# Altium schematic sheet LED.SchDoc: RGB LED.
size 297 x 209 mm; Author: Dmitry Shpakov; Organization: NoName; Revision: Revision; SheetNumber: 8; SheetTotal: 10; PageSize: A4; ProjectName: Project Name
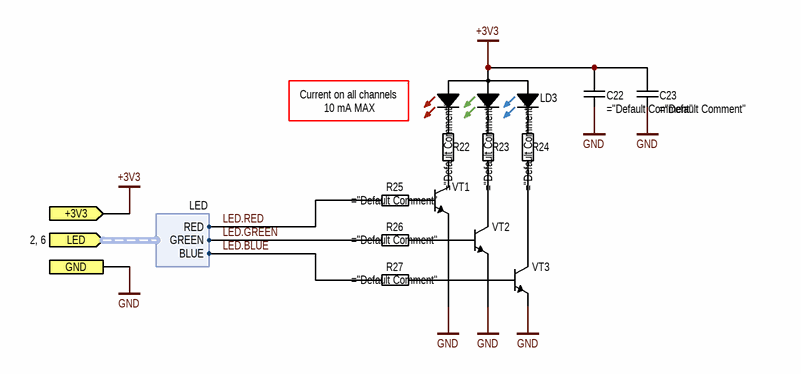
[diagram p0: LED.SchDoc]

## Parts
C22  (no value)
C23  (no value)
LD3  (no value)
R22  (no value)
R23  (no value)
R24  (no value)
R25  (no value)
R26  (no value)
R27  (no value)
VT1  (no value)
VT2  (no value)
VT3  (no value)

## Ports
+3V3 (in, see 2, 3, 6), GND (see 2, 3, 4, 5, 6, 7, 9, 10), LED (in, harness LED, see 2, 6)

## Harnesses
LED: RED, GREEN, BLUE

## Nets
+3V3: C22.2 C23.2 LD3.CA ; port +3V3
GND: C22.1 C23.1 VT1.E VT2.E VT3.E ; port GND
LED.BLUE: R27.1 ; port LED.BLUE
LED.GREEN: R26.1 ; port LED.GREEN
LED.RED: R25.1 ; port LED.RED
NetLD3_BC: LD3.BC R24.2
NetLD3_GC: LD3.GC R23.2
NetLD3_RC: LD3.RC R22.2
NetR22_1: R22.1 VT1.C
NetR23_1: R23.1 VT2.C
NetR24_1: R24.1 VT3.C
NetR25_2: R25.2 VT1.B
NetR26_2: R26.2 VT2.B
NetR27_2: R27.2 VT3.B

## Notes on the sheet
- Current on all channels
  10 mA MAX
- Author
- Date
- Organization
- Page
- Total pages
- Materials
- Page size

## Library data of the parts
C22 = CC0805KPX5R6BB106: CAP CER 10UF 10V X5R 0805; Manufacturer: YAGEO; Type: capacitor; Power Dissipation: * W; Rated Current: * A; Tolerance: 10 %; Other: 10 µF ±10% 10V Ceramic Capacitor X5R 0805 (2012 Metric); Operating Temperature: -55 °C to +85 °C; HelpURL: https://www.digikey.com/en/products/detail/yageo/CC0805KPX5R6BB106/11611309; Default Comment: 10 uF; Rated Voltage: 10 V; Rated Power: * W; Value: 10 uF; Summary: ="Type"+" "+"Part Number"+" "+"Manufacturer"+" "+"Value"+" "+"Tolerance"+" "+"Operating Temperature"+" "+"Case"+" "+"Power Dissipation"+" "+"Rated Current"+" "+"Rated Power"+" "+"Rated Voltage"+" "+"Other"; Assembly: *; Case: 0805; Part Number: CC0805KPX5R6BB106
C23 = CC0805KKX5R6BB105: CAP CER 1UF 10V X5R 0805; Manufacturer: YAGEO; Type: capacitor; Power Dissipation: * W; Rated Current: * A; Tolerance: 10 %; Other: 1 µF ±10% 10V Ceramic Capacitor X5R 0805 (2012 Metric); Operating Temperature: -55 °C to +85 °C; HelpURL: https://www.digikey.com/en/products/detail/yageo/CC0805KKX5R6BB105/2345239; Default Comment: 1 uF; Rated Voltage: 10 V; Rated Power: * W; Value: 1 uF; Summary: ="Type"+" "+"Part Number"+" "+"Manufacturer"+" "+"Value"+" "+"Tolerance"+" "+"Operating Temperature"+" "+"Case"+" "+"Power Dissipation"+" "+"Rated Current"+" "+"Rated Power"+" "+"Rated Voltage"+" "+"Other"; Assembly: *; Case: 0805; Part Number: CC0805KKX5R6BB105
LD3 = 150066M153000: LED RGB DIFFUSED SMD; Manufacturer: Würth Elektronik; Power Dissipation: * W; Tolerance: * %; Other: Red, Green, Blue (RGB) 624nm Red, 525nm Green, 470nm Blue LED Indication - Discrete 2V Red, 3.3V Green, 3.3V Blue 0606 (1616 Metric); Rated Voltage: 2V Red; 3.3V Green; 3.3V Blue; Rated Current: 20 mA; Value: Red; Green; Blue; Operating Temperature: -40 °C to +85 °C; Type: led; HelpURL: https://www.digikey.com/en/products/detail/w%C3%BCrth-elektronik/150066M153000/7315709; Default Comment: 150066M153000; Rated Power: * W; Summary: ="Type"+" "+"Part Number"+" "+"Manufacturer"+" "+"Value"+" "+"Tolerance"+" "+"Operating Temperature"+" "+"Case"+" "+"Power Dissipation"+" "+"Rated Current"+" "+"Rated Power"+" "+"Rated Voltage"+" "+"Other"; Assembly: *; Case: 0606; Part Number: 150066M153000
R22 R23 = RC0603FR-0710RL: RES 10 OHM 1% 1/10W 0603; Manufacturer: YAGEO; Default Comment: 10R; Power Dissipation: 0.1 W; Rated Voltage: * V; Rated Current: * A; Value: 10R; Other: 10 Ohms ±1% 0.1W, 1/10W Chip Resistor 0603 (1608 Metric) Moisture Resistant Thick Film; Operating Temperature: -55 °C to +155 °C; Type: resistor; HelpURL: https://www.digikey.com/en/products/detail/yageo/RC0603FR-0710RL/726879; Rated Power: 0.1 W; Tolerance: 1 %; Summary: ="Type"+" "+"Part Number"+" "+"Manufacturer"+" "+"Value"+" "+"Tolerance"+" "+"Operating Temperature"+" "+"Case"+" "+"Power Dissipation"+" "+"Rated Current"+" "+"Rated Power"+" "+"Rated Voltage"+" "+"Other"; Assembly: *; Case: 0603; Part Number: RC0603FR-0710RL
R24 = RC0603FR-07133RL: RES 133 OHM 1% 1/10W 0603; Manufacturer: YAGEO; Default Comment: 133R; Power Dissipation: 0.1 W; Rated Voltage: * V; Rated Current: * A; Value: 133R; Other: 133 Ohms ±1% 0.1W, 1/10W Chip Resistor 0603 (1608 Metric) Moisture Resistant Thick Film; Operating Temperature: -55 °C to +155 °C; Type: resistor; HelpURL: https://www.digikey.com/en/products/detail/yageo/RC0603FR-07133RL/726936; Rated Power: 0.1 W; Tolerance: 1 %; Summary: ="Type"+" "+"Part Number"+" "+"Manufacturer"+" "+"Value"+" "+"Tolerance"+" "+"Operating Temperature"+" "+"Case"+" "+"Power Dissipation"+" "+"Rated Current"+" "+"Rated Power"+" "+"Rated Voltage"+" "+"Other"; Assembly: *; Case: 0603; Part Number: RC0603FR-07133RL
R25-R27 = RC0603FR-071KL: RES 1K OHM 1% 1/10W 0603; Manufacturer: YAGEO; Rated Voltage: * V; Rated Current: * A; Other: 1 kOhms ±1% 0.1W, 1/10W Chip Resistor 0603 (1608 Metric) Moisture Resistant Thick Film; Operating Temperature: -55 °C to +155 °C; Type: resistor; HelpURL: https://www.digikey.com/en/products/detail/yageo/RC0603FR-071KL/726843; Default Comment: 1k; Power Dissipation: 1/10 W; Rated Power: 1/10 W; Tolerance: 1 %; Value: 1k; Summary: ="Type"+" "+"Part Number"+" "+"Manufacturer"+" "+"Value"+" "+"Tolerance"+" "+"Operating Temperature"+" "+"Case"+" "+"Power Dissipation"+" "+"Rated Current"+" "+"Rated Power"+" "+"Rated Voltage"+" "+"Other"; Assembly: *; Case: 0603; Part Number: RC0603FR-071KL
VT1-VT3 = MMBT2222A-TP: TRANS NPN 40V 0.6A SOT23; Manufacturer: Micro Commercial Co; Type: transistor; Power Dissipation: 350 mW; Rated Voltage: * V; Rated Current: 600 mA; Tolerance: * %; Other: Bipolar (BJT) Transistor NPN 40 V 600 mA 300MHz 350 mW Surface Mount SOT-23; Operating Temperature: -55 °C to +150 °C; HelpURL: https://www.digikey.com/en/products/detail/micro-commercial-co/MMBT2222A-TP/717279; Default Comment: MMBT2222A-TP; Rated Power: 350 mW; Value: npn; Summary: ="Type"+" "+"Part Number"+" "+"Manufacturer"+" "+"Value"+" "+"Tolerance"+" "+"Operating Temperature"+" "+"Case"+" "+"Power Dissipation"+" "+"Rated Current"+" "+"Rated Power"+" "+"Rated Voltage"+" "+"Other"; Assembly: *; Case: SOT-23; Part Number: MMBT2222A-TP